# EAGLE schematic breadboard-mcp2515 (EAGLE 9.6.0)
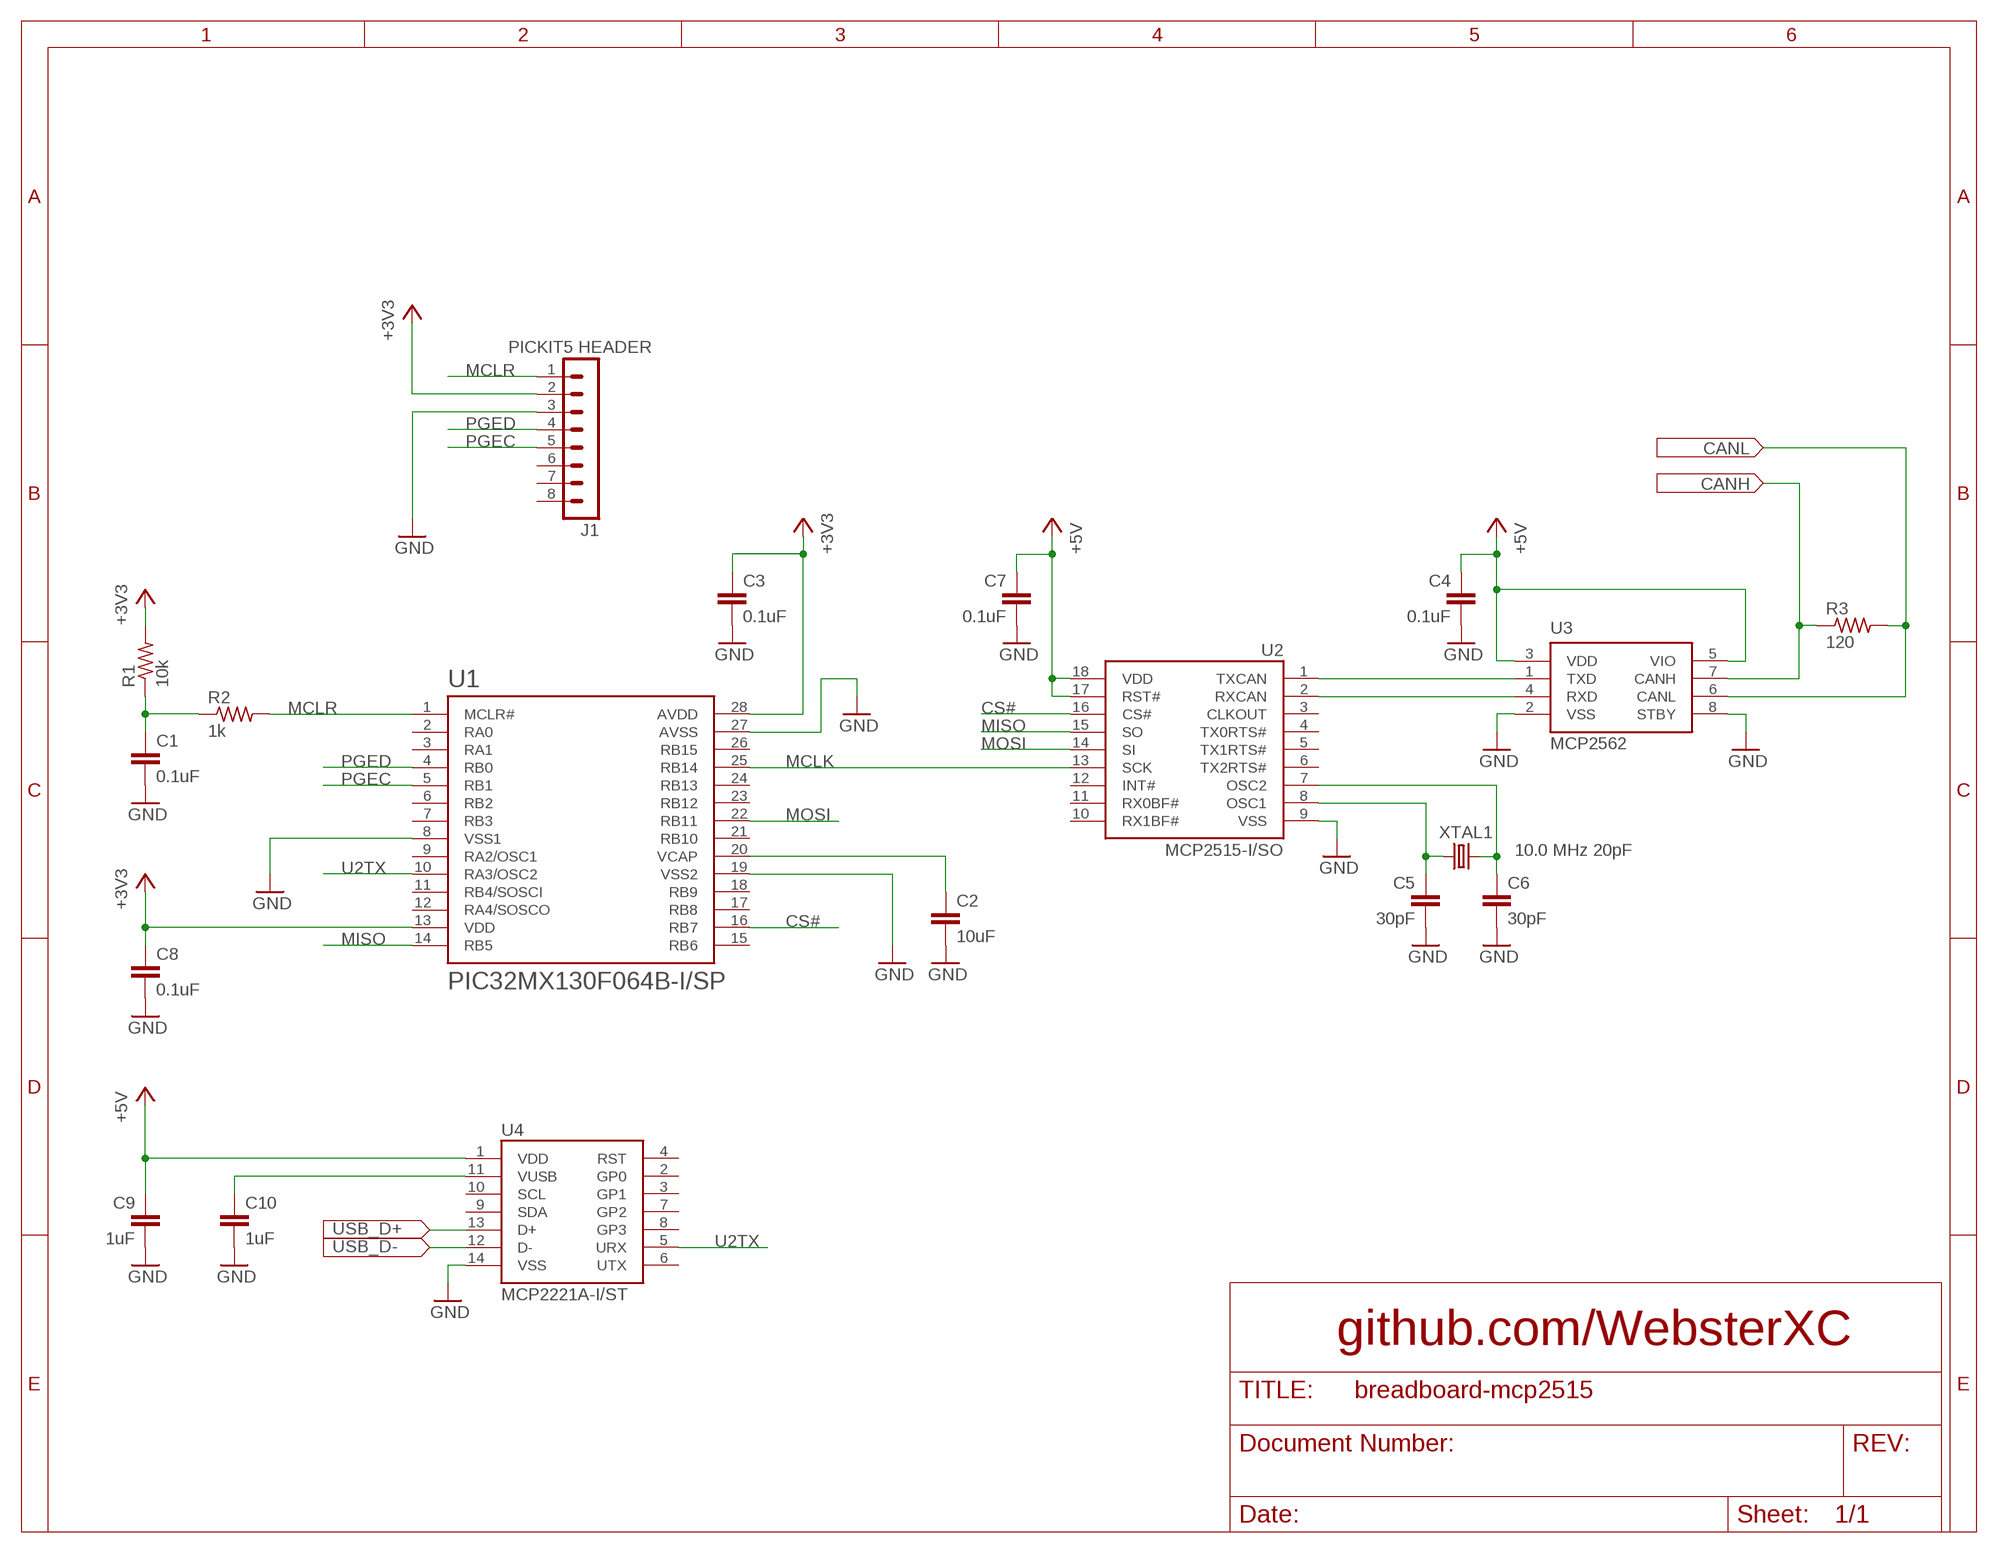
[diagram p0: schematic, sheet 1]

## Parts
C1  0.1uF  C-EUC0603  [C0603]
C2  10uF  C-EUC0603  [C0603]
C3  0.1uF  C-EUC0603  [C0603]
C4  0.1uF  C-EUC0603  [C0603]
C5  30pF  C-EUC0603  [C0603]
C6  30pF  C-EUC0603  [C0603]
C7  0.1uF  C-EUC0603  [C0603]
C8  0.1uF  C-EUC0603  [C0603]
C9  1uF  C-EUC0603  [C0603]
C10  1uF  C-EUC0603  [C0603]
J1  PICKIT5 HEADER  MA08-1  [MA08-1]
R1  10k  R-US_R0603  [R0603]
R2  1k  R-US_R0603  [R0603]
R3  120  R-US_R0603  [R0603]
U1  PIC32MX130F064B-I/SP  PIC32MX130F  [SSOP28]
U2  MCP2515-I/SO  [SOIC18L]
U3  MCP2562  [SOIC8]
U4  MCP2221A-I/ST  [TSSOP14]
XTAL1  10.0 MHz 20pF  CRYSTAL68SMX  [86SMX]

## Nets
+3V3: C3.1 C8.1 J1.2 R1.2 U1.13(VDD) U1.28(AVDD)
+5V: C4.1 C7.1 C9.1 U2.17(RST#) U2.18(VDD) U3.3(VDD) U3.5(VIO) U4.1(VDD)
CS#: U1.16(RB7) U2.16(CS#)
GND: C1.2 C2.2 C3.2 C4.2 C5.2 C6.2 C7.2 C8.2 C9.2 C10.2 J1.3 U1.8(VSS1) U1.19(VSS2) U1.27(AVSS) U2.9(VSS) U3.2(VSS) U3.8(STBY) U4.14(VSS)
MCLK: U1.25(RB14) U2.13(SCK)
MCLR: J1.1 R2.2 U1.1(MCLR#)
MISO: U1.14(RB5) U2.15(SO)
MOSI: U1.22(RB11) U2.14(SI)
N$1: C1.1 R1.1 R2.1
N$2: U4.13(D+)
N$3: C2.1 U1.20(VCAP)
N$4: U4.12(D-)
N$5: U2.1(TXCAN) U3.1(TXD)
N$6: U2.2(RXCAN) U3.4(RXD)
N$7: C5.1 U2.8(OSC1) XTAL1.1
N$8: C6.1 U2.7(OSC2) XTAL1.4
N$9: C10.1 U4.11(VUSB)
N$10: R3.1 U3.7(CANH)
N$11: R3.2 U3.6(CANL)
PGEC: J1.5 U1.5(RB1)
PGED: J1.4 U1.4(RB0)
U2TX: U1.10(RA3/OSC2) U4.5(URX)
Unconnected: J1.6 J1.7 J1.8 U1.2(RA0) U1.3(RA1) U1.6(RB2) U1.7(RB3) U1.9(RA2/OSC1) U1.11(RB4/SOSCI) U1.12(RA4/SOSCO) U1.15(RB6) U1.17(RB8) U1.18(RB9) U1.21(RB10) U1.23(RB12) U1.24(RB13) U1.26(RB15) U2.3(CLKOUT) U2.4(TX0RTS#) U2.5(TX1RTS#) U2.6(TX2RTS#) U2.10(RX1BF#) U2.11(RX0BF#) U2.12(INT#) U4.2(GP0) U4.3(GP1) U4.4(RST) U4.6(UTX) U4.7(GP2) U4.8(GP3) U4.9(SDA) U4.10(SCL)

## Notes on the sheet
- github.com/WebsterXC

## Library data of the parts
C1-C10 = rcl:C-EU: CAPACITOR, European symbol; SPICEPREFIX: C
J1 = con-lstb:MA08-1: PIN HEADER; OC_FARNELL: unknown; OC_NEWARK: unknown
R1-R3 = rcl:R-US_: RESISTOR, American symbol; SPICEPREFIX: R
U1 = microchip2024:PIC32MX130F
U2 = microchip2024:MCP2515
U3 = microchip2024:MCP2562
U4 = microchip2024:MCP2221A
XTAL1 = crystal:CRYSTAL: CRYSTAL; OC_FARNELL: 6344860; OC_NEWARK: unknown